# EAGLE schematic Schematic (EAGLE 9.6.2)
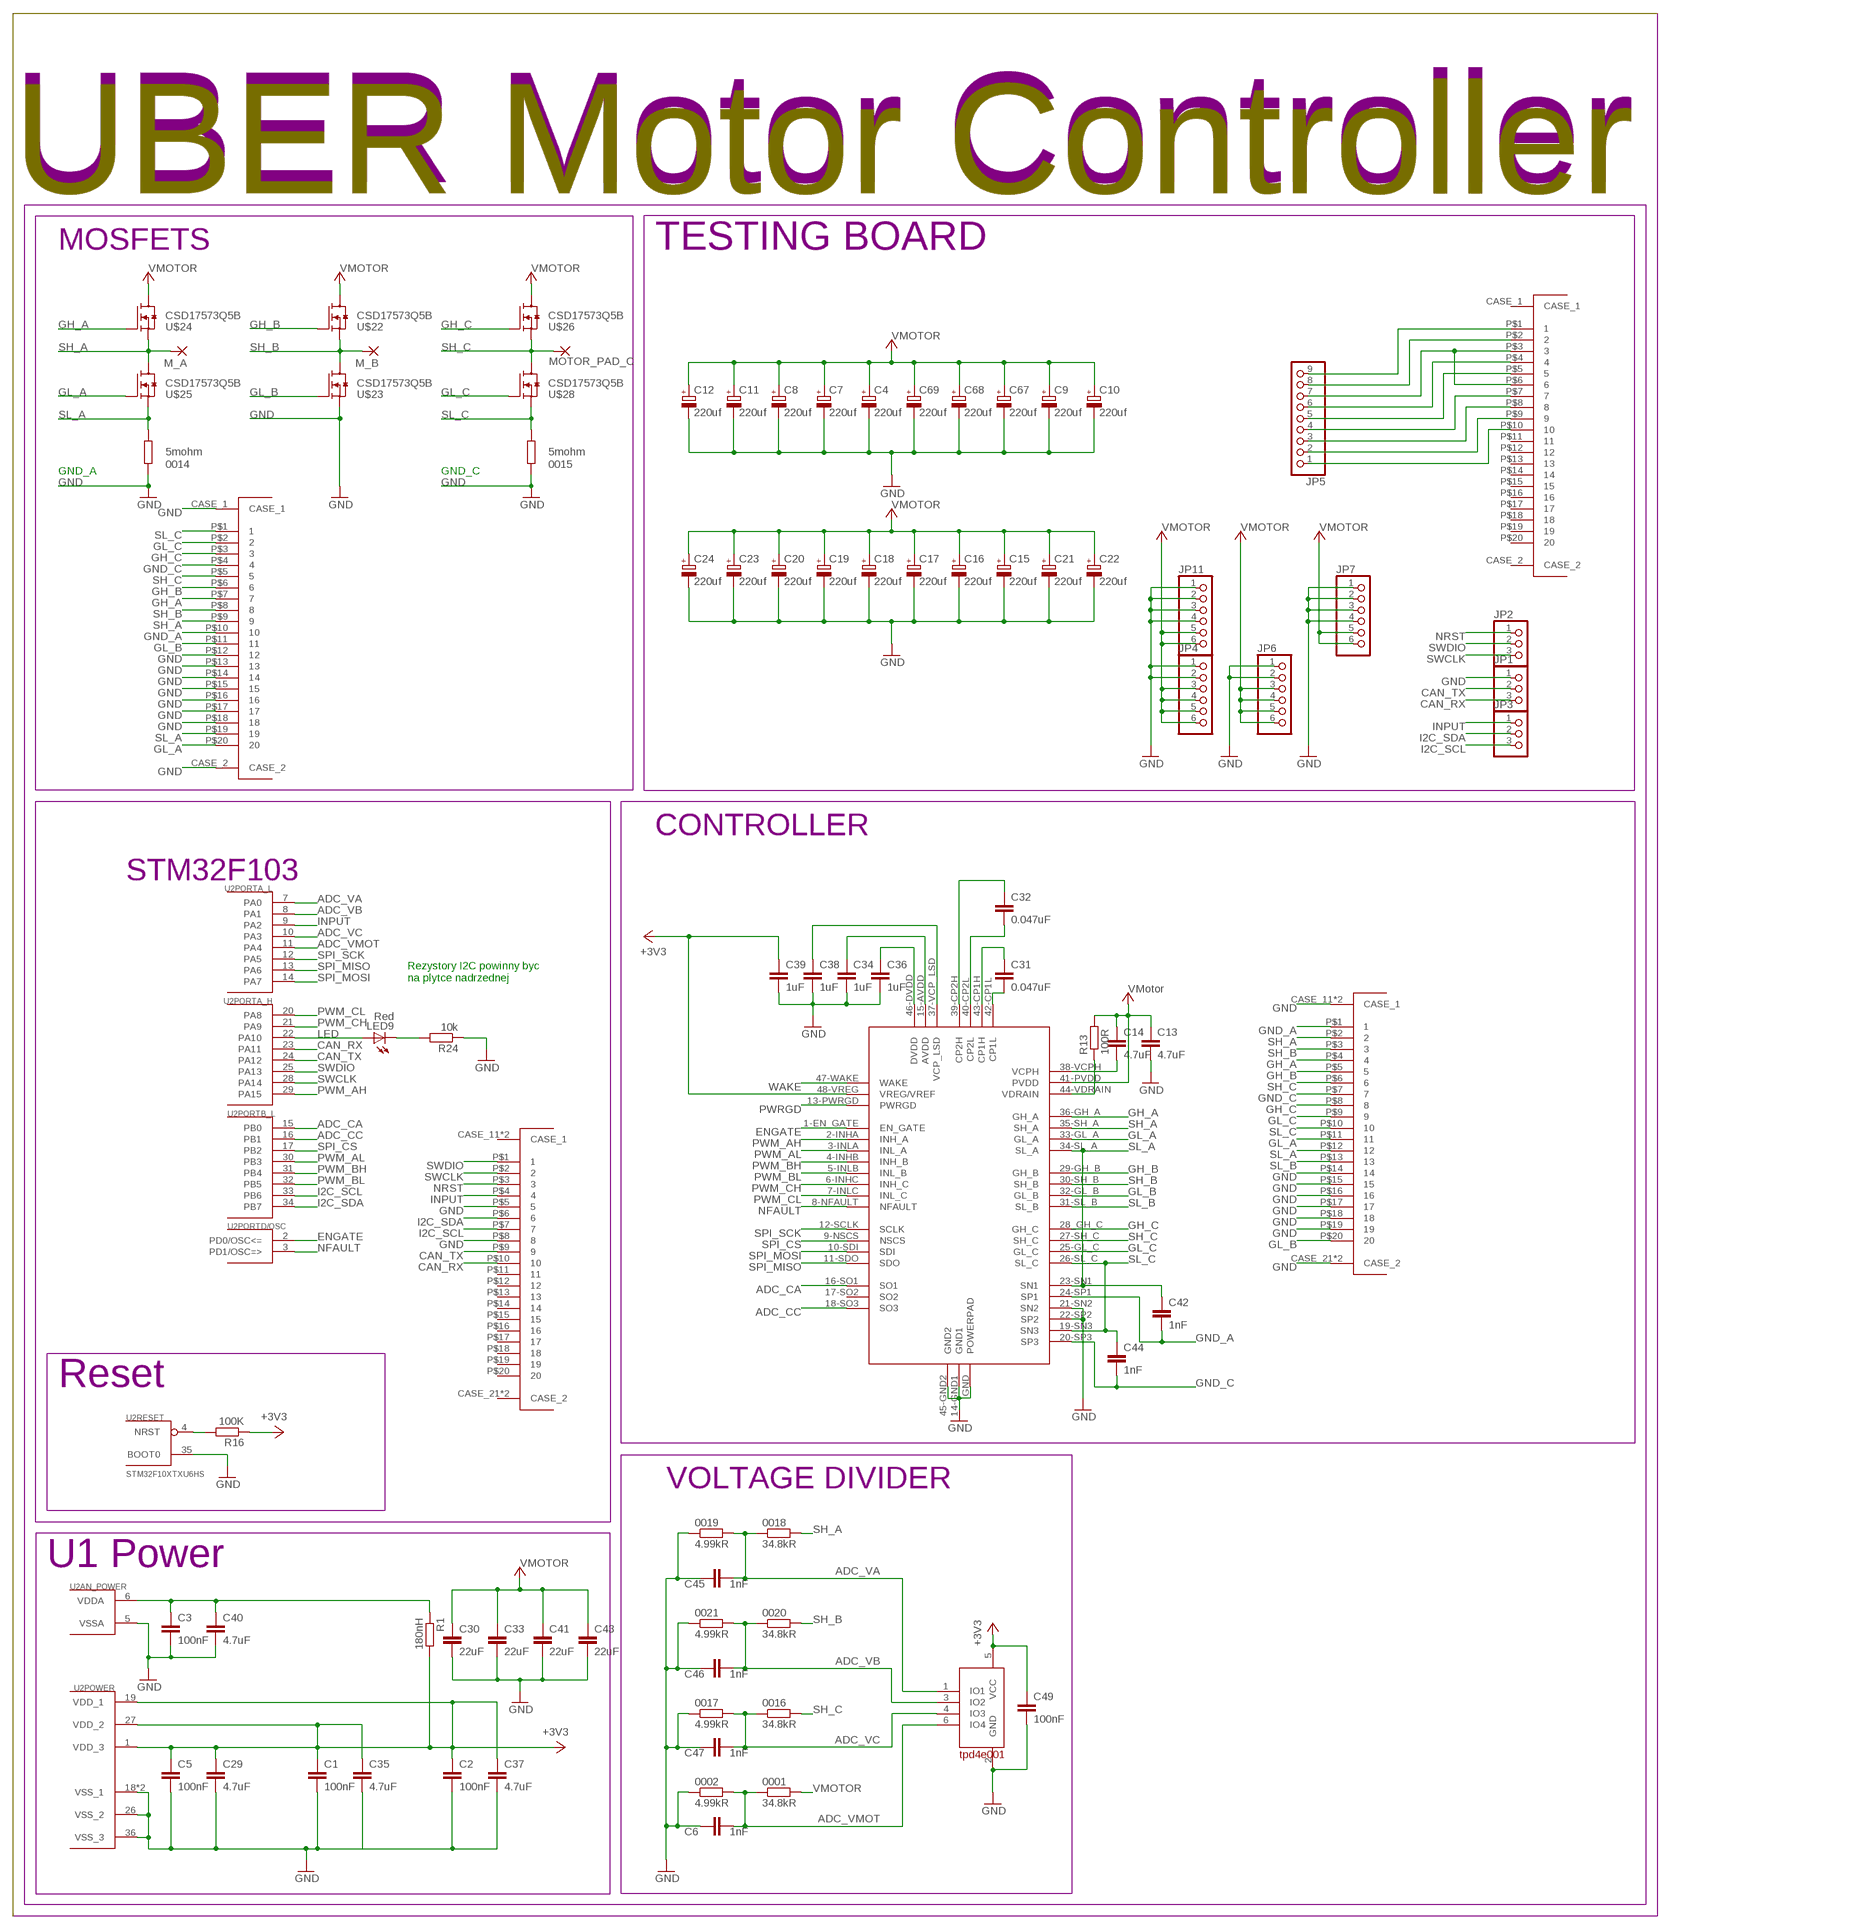
[diagram p0: schematic, sheet 1]

## Parts
0001  34.8kR  R-EU_R0402  [R0402]
0002  4.99kR  R-EU_R0402  [R0402]
0014  5mohm  R-EU_R2512  [R2512]
0015  5mohm  R-EU_R2512  [R2512]
0016  34.8kR  R-EU_R0402  [R0402]
0017  4.99kR  R-EU_R0402  [R0402]
0018  34.8kR  R-EU_R0402  [R0402]
0019  4.99kR  R-EU_R0402  [R0402]
0020  34.8kR  R-EU_R0402  [R0402]
0021  4.99kR  R-EU_R0402  [R0402]
C1  100nF  C-EU  [R0402]
C2  100nF  C-EU  [R0402]
C3  100nF  C-EU  [R0402]
C4  220uf  CPOL-EU150CLZ-0810  [150CLZ-0810]
C5  100nF  C-EU  [R0402]
C6  1nF  C-EU  [R0402]
C7  220uf  CPOL-EU150CLZ-0810  [150CLZ-0810]
C8  220uf  CPOL-EU150CLZ-0810  [150CLZ-0810]
C9  220uf  CPOL-EU150CLZ-0810  [150CLZ-0810]
C10  220uf  CPOL-EU150CLZ-0810  [150CLZ-0810]
C11  220uf  CPOL-EU150CLZ-0810  [150CLZ-0810]
C12  220uf  CPOL-EU150CLZ-0810  [150CLZ-0810]
C13  4.7uF  C-EUC0805  [C0805]
C14  4.7uF  C-EUC0805  [C0805]
C15  220uf  CPOL-EU150CLZ-0810  [150CLZ-0810]
C16  220uf  CPOL-EU150CLZ-0810  [150CLZ-0810]
C17  220uf  CPOL-EU150CLZ-0810  [150CLZ-0810]
C18  220uf  CPOL-EU150CLZ-0810  [150CLZ-0810]
C19  220uf  CPOL-EU150CLZ-0810  [150CLZ-0810]
C20  220uf  CPOL-EU150CLZ-0810  [150CLZ-0810]
C21  220uf  CPOL-EU150CLZ-0810  [150CLZ-0810]
C22  220uf  CPOL-EU150CLZ-0810  [150CLZ-0810]
C23  220uf  CPOL-EU150CLZ-0810  [150CLZ-0810]
C24  220uf  CPOL-EU150CLZ-0810  [150CLZ-0810]
C29  4.7uF  C-EU  [R0402]
C30  22uF  C-EUC1206  [C1206]
C31  0.047uF  C-EU  [R0402]
C32  0.047uF  C-EU  [R0402]
C33  22uF  C-EUC1206  [C1206]
C34  1uF  C-EU  [R0402]
C35  4.7uF  C-EU  [R0402]
C36  1uF  C-EU  [R0402]
C37  4.7uF  C-EU  [R0402]
C38  1uF  C-EU  [R0402]
C39  1uF  C-EU  [R0402]
C40  4.7uF  C-EU  [R0402]
C41  22uF  C-EUC1206  [C1206]
C42  1nF  C-EU  [R0402]
C43  22uF  C-EUC1206  [C1206]
C44  1nF  C-EU  [R0402]
C45  1nF  C-EU  [R0402]
C46  1nF  C-EU  [R0402]
C47  1nF  C-EU  [R0402]
C49  100nF  C-EU  [R0402]
C67  220uf  CPOL-EU150CLZ-0810  [150CLZ-0810]
C68  220uf  CPOL-EU150CLZ-0810  [150CLZ-0810]
C69  220uf  CPOL-EU150CLZ-0810  [150CLZ-0810]
JP1  PINHD-1X3  [1X03]
JP2  PINHD-1X3  [1X03]
JP3  PINHD-1X3  [1X03]
JP4  PINHD-1X6  [1X06]
JP5  PINHD-1X9  [1X09-BIG]
JP6  PINHD-1X6  [1X06]
JP7  PINHD-1X6  [1X06]
JP11  PINHD-1X6  [1X06]
LED9  Red  LEDSML0603  [SML0603]
M_A  SMD5  [SMD2,54-5,08]
M_B  SMD5  [SMD2,54-5,08]
MOTOR_PAD_C  SMD5  [SMD2,54-5,08]
R1  180nH  R-EU_R0603  [R0603]
R13  100R  R-EU_R0603  [R0603]
R16  100K  R-EU_R0402  [R0402]
R24  10k  R-EU_R0402  [R0402]
U2  STM32F10XTXU6HS  [VFQFPN36-HS]
U$1  RECEPTACLE_20_0.4_5024262030  [RECEPTACLE_20_0.4_5024262030]
U$2  PLUG_20_0.4_5024302012  [PLUG_20_0.4_5024302012]
U$21  DRV8305  [S-PQFP-G48]
U$22  CSD17573Q5B  [Q5B]
U$23  CSD17573Q5B  [Q5B]
U$24  CSD17573Q5B  [Q5B]
U$25  CSD17573Q5B  [Q5B]
U$26  CSD17573Q5B  [Q5B]
U$28  CSD17573Q5B  [Q5B]
U$30  PLUG_20_0.4_5024302012  [PLUG_20_0.4_5024302012]
U$31  TPD4E001  [SOT-23]
U$32  RECEPTACLE_20_0.4_5024262030  [RECEPTACLE_20_0.4_5024262030]

## Nets
+3V3: C1.1 C2.1 C5.1 C29.1 C35.1 C37.1 C39.1 C49.1 R1.2 R16.1 U2.1(POWER:VDD_3) U2.19(POWER:VDD_1) U2.27(POWER:VDD_2) U$21.48-VREG(VREG/VREF) U$31.5(VCC)
ADC_CA: U2.15(PORTB_L:PB0) U$21.16-SO1(SO1)
ADC_CC: U2.16(PORTB_L:PB1) U$21.18-SO3(SO3)
ADC_VA: 0018.1 0019.2 C45.1 U2.7(PORTA_L:PA0) U$31.1(IO1)
ADC_VB: 0020.1 0021.2 C46.1 U2.8(PORTA_L:PA1) U$31.3(IO2)
ADC_VC: 0016.1 0017.2 C47.1 U2.10(PORTA_L:PA3) U$31.4(IO3)
ADC_VMOT: 0001.1 0002.2 C6.1 U2.11(PORTA_L:PA4) U$31.6(IO4)
CAN_RX: JP1.3 U2.23(PORTA_H:PA11) U$1.P$10
CAN_TX: JP1.2 U2.24(PORTA_H:PA12) U$1.P$9
ENGATE: U2.2(PORTD/OSC:PD0/OSC<=) U$21.1-EN_GATE(EN_GATE)
GH_A: U$21.36-GH_A(GH_A) U$24.G U$30.P$7 U$32.P$4
GH_B: U$21.29-GH_B(GH_B) U$22.G U$30.P$6 U$32.P$5
GH_C: U$21.28_GH_C(GH_C) U$26.G U$30.P$3 U$32.P$8
GL_A: U$21.33-GL_A(GL_A) U$25.G U$30.P$20 U$32.P$11
GL_B: U$21.32-GL_B(GL_B) U$23.G U$30.P$11 U$32.P$20
GL_C: U$21.25-GL_C(GL_C) U$28.G U$30.P$2 U$32.P$9
GND: 0002.1 0014.1 0015.1 0017.1 0019.1 0021.1 C1.2 C2.2 C3.2 C4.- C5.2 C6.2 C7.- C8.- C9.- C10.- C11.- C12.- C13.2 C15.- C16.- C17.- C18.- C19.- C20.- C21.- C22.- C23.- C24.- C29.2 C30.2 C33.2 C34.2 C35.2 C36.2 C37.2 C38.2 C39.2 C40.2 C41.2 C43.2 C45.2 C46.2 C47.2 C49.2 C67.- C68.- C69.- JP1.1 JP4.1 JP4.2 JP6.1 JP6.2 JP7.1 JP7.2 JP7.3 JP7.4 JP11.1 JP11.2 JP11.3 JP11.4 R24.1 U2.5(AN_POWER:VSSA) U2.18(POWER:VSS_1) U2.26(POWER:VSS_2) U2.35(RESET:BOOT0) U2.36(POWER:VSS_3) U2.GND(POWER:VSS_1) U$1.P$5 U$1.P$8 U$21.14-GND1(GND1) U$21.21-SN2(SN2) U$21.22-SP2(SP2) U$21.45-GND2(GND2) U$21.GND(POWERPAD) U$23.S U$30.CASE_1 U$30.CASE_2 U$30.P$12 U$30.P$13 U$30.P$14 U$30.P$15 U$30.P$16 U$30.P$17 U$30.P$18 U$31.2(GND) U$32.CASE_11(CASE_1) U$32.CASE_12(CASE_1) U$32.CASE_21(CASE_2) U$32.CASE_22(CASE_2) U$32.P$14 U$32.P$15 U$32.P$16 U$32.P$17 U$32.P$18 U$32.P$19
GND_A: C42.2 U$21.24-SP1(SP1) U$30.P$10 U$32.P$1
GND_C: C44.2 U$21.20-SP3(SP3) U$30.P$4 U$32.P$7
I2C_SCL: JP3.3 U2.33(PORTB_L:PB6) U$1.P$7
I2C_SDA: JP3.2 U2.34(PORTB_L:PB7) U$1.P$6
INPUT: JP3.1 U2.9(PORTA_L:PA2) U$1.P$4
LED: LED9.A U2.22(PORTA_H:PA10)
N$1: JP5.9 U$2.P$1
N$2: C3.1 C40.1 R1.1 U2.6(AN_POWER:VDDA)
N$3: JP5.8 U$2.P$2
N$4: JP5.7 U$2.P$3 U$2.P$6
N$5: JP5.6 U$2.P$4
N$6: JP5.5 U$2.P$5
N$7: JP5.2 U$2.P$9
N$8: JP5.4 U$2.P$7
N$9: JP5.3 U$2.P$8
N$10: C36.1 U$21.46-DVDD(DVDD)
N$11: JP5.1 U$2.P$10
N$12: C34.1 U$21.15-AVDD(AVDD)
N$13: C38.1 U$21.37-VCP_LSD(VCP_LSD)
N$14: C31.2 U$21.42-CP1L(CP1L)
N$16: C31.1 U$21.43-CP1H(CP1H)
N$20: C32.2 U$21.40-CP2L(CP2L)
N$21: C32.1 U$21.39-CP2H(CP2H)
N$22: R13.1 U$21.44-VDRAIN(VDRAIN)
N$23: C14.2 U$21.38-VCPH(VCPH)
N$81: LED9.C R24.2
NFAULT: U2.3(PORTD/OSC:PD1/OSC=>) U$21.8-NFAULT(NFAULT)
NRST: JP2.1 R16.2 U2.4(RESET:NRST) U$1.P$3
PWM_AH: U2.29(PORTA_H:PA15) U$21.2-INHA(INH_A)
PWM_AL: U2.30(PORTB_L:PB3) U$21.3-INLA(INL_A)
PWM_BH: U2.31(PORTB_L:PB4) U$21.4-INHB(INH_B)
PWM_BL: U2.32(PORTB_L:PB5) U$21.5-INLB(INL_B)
PWM_CH: U2.21(PORTA_H:PA9) U$21.6-INHC(INH_C)
PWM_CL: U2.20(PORTA_H:PA8) U$21.7-INLC(INL_C)
PWRGD: U$21.13-PWRGD(PWRGD)
SH_A: 0018.2 M_A.1(P) U$21.35-SH_A(SH_A) U$24.S U$25.D U$30.P$9 U$32.P$2
SH_B: 0020.2 M_B.1(P) U$21.30-SH_B(SH_B) U$22.S U$23.D U$30.P$8 U$32.P$3
SH_C: 0016.2 MOTOR_PAD_C.1(P) U$21.27-SH_C(SH_C) U$26.S U$28.D U$30.P$5 U$32.P$6
SL_A: 0014.2 C42.1 U$21.23-SN1(SN1) U$21.34-SL_A(SL_A) U$25.S U$30.P$19 U$32.P$12
SL_B: U$21.31-SL_B(SL_B) U$32.P$13
SL_C: 0015.2 C44.1 U$21.19-SN3(SN3) U$21.26-SL_C(SL_C) U$28.S U$30.P$1 U$32.P$10
SPI_CS: U2.17(PORTB_L:PB2) U$21.9-NSCS(NSCS)
SPI_MISO: U2.13(PORTA_L:PA6) U$21.11-SDO(SDO)
SPI_MOSI: U2.14(PORTA_L:PA7) U$21.10-SDI(SDI)
SPI_SCK: U2.12(PORTA_L:PA5) U$21.12-SCLK(SCLK)
SWCLK: JP2.3 U2.28(PORTA_H:PA14) U$1.P$2
SWDIO: JP2.2 U2.25(PORTA_H:PA13) U$1.P$1
VMOTOR: 0001.2 C4.+ C7.+ C8.+ C9.+ C10.+ C11.+ C12.+ C13.1 C14.1 C15.+ C16.+ C17.+ C18.+ C19.+ C20.+ C21.+ C22.+ C23.+ C24.+ C30.1 C33.1 C41.1 C43.1 C67.+ C68.+ C69.+ JP4.3 JP4.4 JP4.5 JP4.6 JP6.3 JP6.4 JP6.5 JP6.6 JP7.5 JP7.6 JP11.5 JP11.6 R13.2 U$21.41-PVDD(PVDD) U$22.D U$24.D U$26.D ; supply symbol labelled VMotor
WAKE: U$21.47-WAKE(WAKE)
Unconnected: U$1.CASE_11(CASE_1) U$1.CASE_12(CASE_1) U$1.CASE_21(CASE_2) U$1.CASE_22(CASE_2) U$1.P$11 U$1.P$12 U$1.P$13 U$1.P$14 U$1.P$15 U$1.P$16 U$1.P$17 U$1.P$18 U$1.P$19 U$1.P$20 U$2.CASE_1 U$2.CASE_2 U$2.P$11 U$2.P$12 U$2.P$13 U$2.P$14 U$2.P$15 U$2.P$16 U$2.P$17 U$2.P$18 U$2.P$19 U$2.P$20 U$21.17-SO2(SO2)

## Notes on the sheet
- UBER Motor Controller | UBER Motor Controller
- MOSFETS | TESTING BOARD
- GND_A | GND_C
- CONTROLLER
- STM32F103
- Rezystory I2C powinny byc 
  na plytce nadrzednej
- Reset
- VOLTAGE DIVIDER
- U1 Power

## Library data of the parts
0001 0002 0016-0021 R16 R24 = rcl:R-EU_: RESISTOR, European symbol; SPICEPREFIX: R
0014 0015 R1 R13 = resistor:R-EU_: RESISTOR, European symbol
C1-C3 C5 C6 C29 C31 C32 C34-C40 C42 C44-C47 C49 = rcl:C-EU: CAPACITOR, European symbol
C4 C7-C12 C15-C24 C67-C69 = rcl:CPOL-EU: POLARIZED CAPACITOR, European symbol; SPICEPREFIX: C
C13 C14 C30 C33 C41 C43 = rcl:C-EU: CAPACITOR, European symbol; SPICEPREFIX: C
JP1-JP3 = adafruit:PINHD-1X3: PIN HEADER
JP4 JP6 JP7 JP11 = adafruit:PINHD-1X6: PIN HEADER
JP5 = adafruit:PINHD-1X9: Pin header 1x10 0.1" spacing With round pins
LED9 = led:LED: LED OSRAM: - CHIPLED LG R971, LG N971, LY N971, LG Q971, LY Q971, LO R971, LY R971 LH N974, LH R974 LS Q976, LO Q976, LY Q976 LO Q996 - Hyper CHIPLED LW Q18S LB Q993, LB Q99A, LB R99A - SideLED LS A670, LO A670, LY A670, LG A670, LP A670 LB A673, LV A673, LT A673, LW A673 LH A674 LY A675 LS A676, LA A676, LO A676, LY A676, LW A676 LS A679, LY A679, LG A679 - Hyper Micro SIDELED® LS Y876, LA Y876, LO Y876, LY Y876 LT Y87S - SmartLED LW L88C, LW L88S LB L89C, LB L89S, LG L890 LS L89K, LO L89K, LY L89K LS L896, LA L896, LO L896, LY L896 - TOPLED LS T670, LO T670, LY T670, LG T670, LP T670 LSG T670, LSP T670, LSY T670, LOP T670, LYG T670 LG T671, LOG T671, LSG T671 LB T673, LV T673, LT T673, LW T673 LH T674 LS T676, LA T676, LO T676, LY T676, LB T676, LH T676, LSB T676, LW T676 LB T67C, LV T67C, LT T67C, LS T67K, LO T67K, LY T67K, LW E67C LS E67B, LA E67B, LO E67B, LY E67B, LB E67C, LV E67C, LT E67C LW T67C LS T679, LY T679, LG T679 LS T770, LO T770, LY T770, LG T770, LP T770 LB T773, LV T773, LT T773, LW T773 LH T774 LS E675, LA E675, LY E675, LS T675 LS T776, LA T776, LO T776, LY T776, LB T776 LHGB T686 LT T68C, LB T68C - Hyper Mini TOPLED® LB M676 - Mini TOPLED Santana® LG M470 LS M47K, LO M47K, LY M47K Source: http://www.osram.convergy.de LUXEON: - LUMILED® LXK2-PW12-R00, LXK2-PW12-S00, LXK2-PW14-U00, LXK2-PW14-V00 LXK2-PM12-R00, LXK2-PM12-S00, LXK2-PM14-U00 LXK2-PE12-Q00, LXK2-PE12-R00, LXK2-PE12-S00, LXK2-PE14-T00, LXK2-PE14-U00 LXK2-PB12-K00, LXK2-PB12-L00, LXK2-PB12-M00, LXK2-PB14-N00, LXK2-PB14-P00, LXK2-PB14-Q00 LXK2-PR12-L00, LXK2-PR12-M00, LXK2-PR14-Q00, LXK2-PR14-R00 LXK2-PD12-Q00, LXK2-PD12-R00, LXK2-PD12-S00 LXK2-PH12-R00, LXK2-PH12-S00 LXK2-PL12-P00, LXK2-PL12-Q00, LXK2-PL12-R00 Source: www.luxeon.com KINGBRIGHT: KA-3528ASYC Source: www.kingbright.com
M_A M_B MOTOR_PAD_C = wirepad:SMD5: SMD PAD
U2 = stm32:STM32F10XTXU6: STM32F101/103 36pad VFQPFN36
U$1 U$32 = Molex_2:RECEPTACLE_20_0.4_5024262030
U$2 U$30 = Molex_2:PLUG_20_0.4_5024302012
U$21 = drv8305lbr:DRV8305
U$22-U$26 U$28 = CSD_Mosfet:CSD17573Q5B
U$31 = tpd4e001:TPD4E001